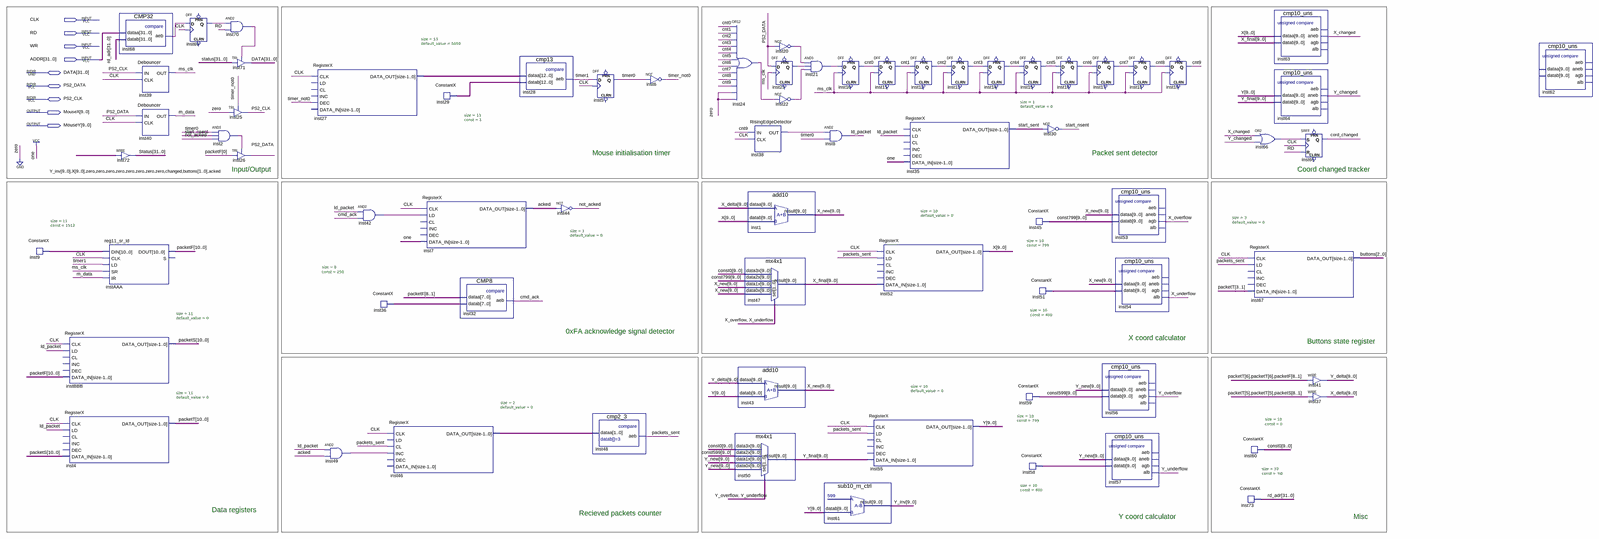
[diagram p0: schematic sheet, whole]
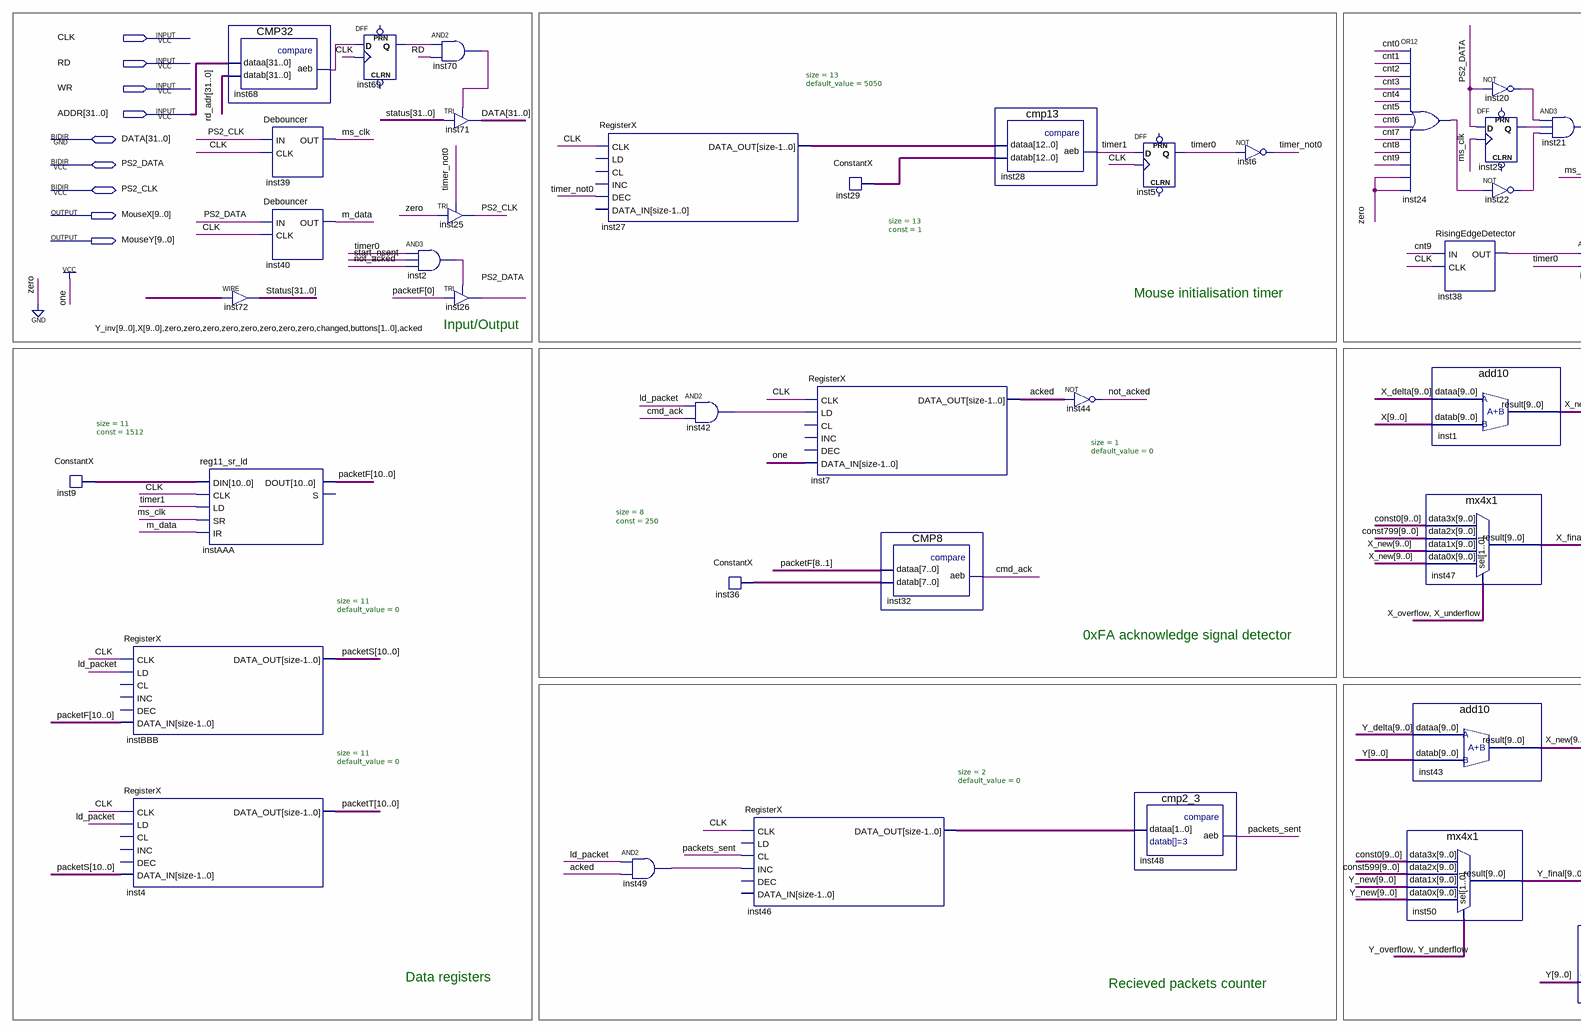
[diagram p1: schematic sheet, left part]
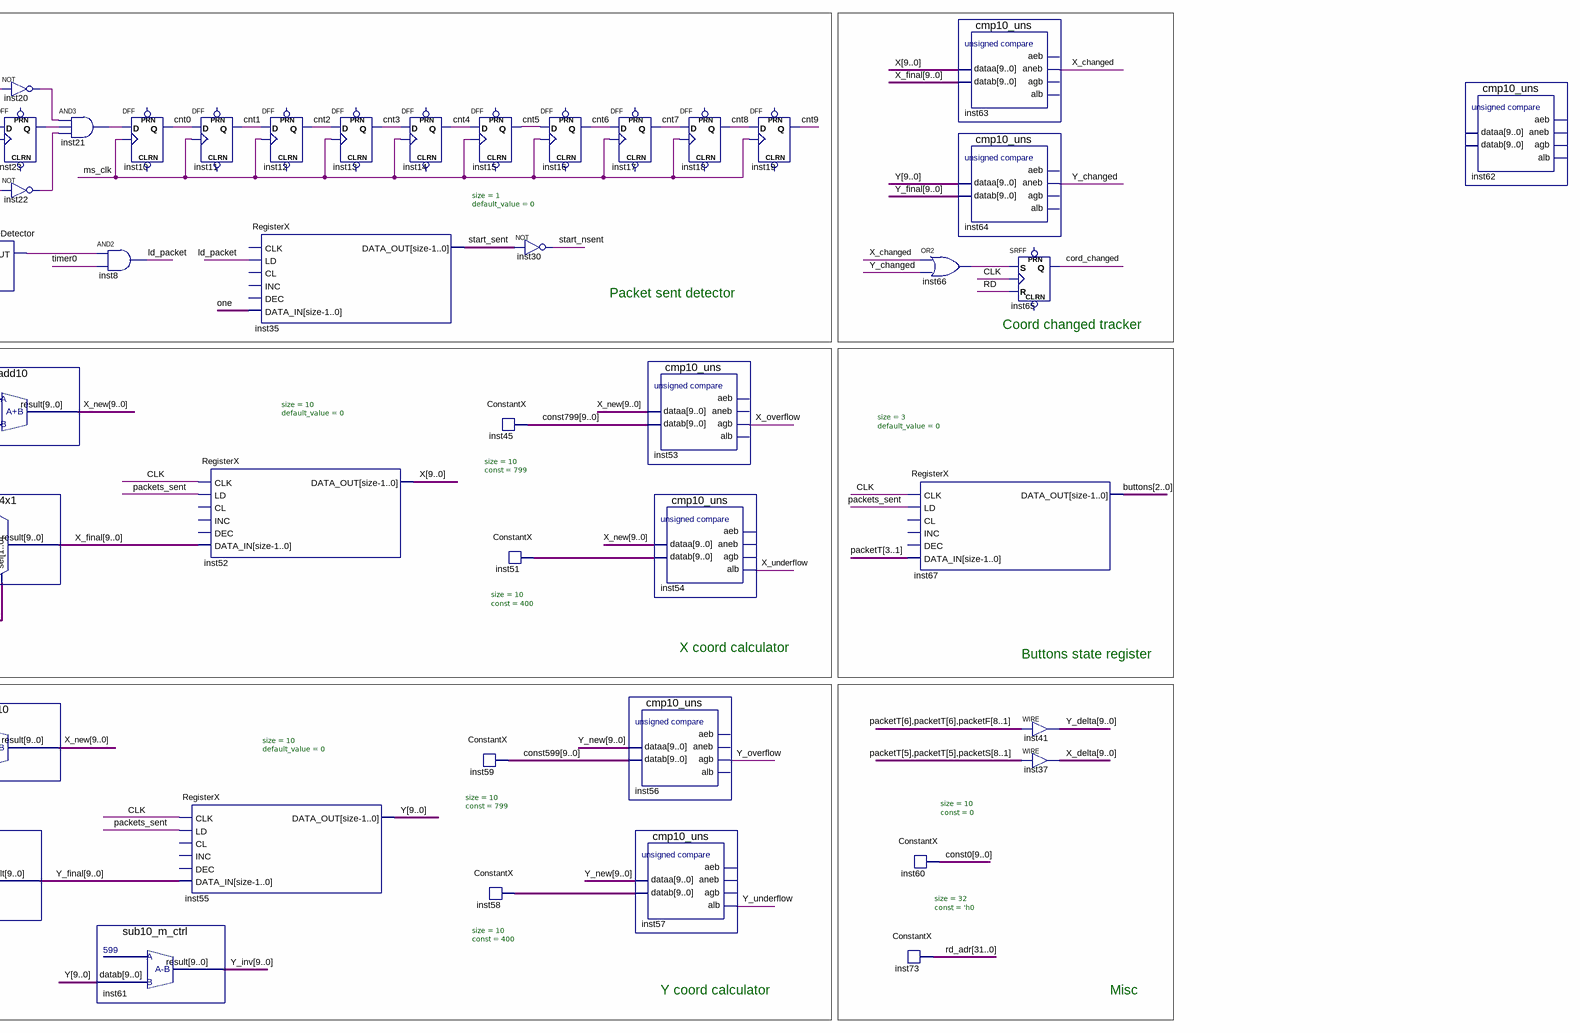
[diagram p2: schematic sheet, right part]
// Quartus schematic MouseController.bdf as structural Verilog: 71 symbols, 9 pins
module MouseController (
  input  CLK,
  input  RD,
  input  WR,
  input  [31:0] ADDR,
  inout  [31:0] DATA,
  inout  PS2_DATA,
  inout  PS2_CLK,
  output [9:0] MouseX,
  output [9:0] MouseY
);

  wire acked, changed, cmd_ack, cnt0, cnt1, cnt2, cnt3, cnt4, cnt5, cnt6, cnt7, cnt8, cnt9, cord_changed,
       inst2_out, inst20_out, inst21_out, inst22_out, inst23_q, inst24_out, inst38_out, inst42_out,
       inst49_out, inst66_out, inst68_aeb, inst69_q, inst70_out, ld_packet, m_data, ms_clk, not_acked,
       packets_sent, start_nsent, start_sent, timer0, timer1, timer_not0, X_changed, X_overflow, X_underflow,
       Y_changed, Y_overflow, Y_underflow;
  wire [1:0] inst46_data_out;
  wire [2:0] buttons;
  wire [7:0] inst36_data_out;
  wire [9:0] const0, const599, const799, inst51_data_out, inst58_data_out, X, X_delta, X_final, X_new, Y,
       Y_delta, Y_final, Y_inv, Y_new;
  wire [10:0] inst9_data_out, packetF, packetS, packetT;
  wire [12:0] inst27_data_out, inst29_data_out;
  wire [31:0] rd_adr, Status;

  ConstantX #(.size(11), .\const (1512)) inst9 (.DATA_OUT(inst9_data_out));
  RegisterX #(.size(11), .default_value(0)) instBBB (
    .CLK(CLK), .LD(ld_packet), .DATA_IN(packetF), .DATA_OUT(packetS));  // open: CL, INC, DEC
  RegisterX #(.size(11), .default_value(0)) inst4 (
    .CLK(CLK), .LD(ld_packet), .DATA_IN(packetS), .DATA_OUT(packetT));  // open: CL, INC, DEC
  reg11_sr_ld instAAA (
    .DIN(inst9_data_out), .CLK(CLK), .LD(timer1), .SR(ms_clk), .IR(m_data), .DOUT(packetF));  // open: S
  CMP32 inst68 (.dataa(ADDR), .datab(rd_adr), .aeb(inst68_aeb));
  Debouncer inst39 (.IN(PS2_CLK), .CLK(CLK), .OUT(ms_clk));
  Debouncer inst40 (.IN(PS2_DATA), .CLK(CLK), .OUT(m_data));
  assign Status = {Y_inv, X, {8{1'b0}}, changed, buttons[1:0], acked};  // WIRE inst72
  DFF inst69 (.CLK(CLK), .D(inst68_aeb), .Q(inst69_q));  // open: CLRN, PRN
  and inst2 (inst2_out, timer0, start_nsent, not_acked);
  and inst70 (inst70_out, inst69_q, RD);
  TRI inst71[31:0] (.IN(Status), .OE(inst70_out), .OUT(DATA));
  TRI inst25 (.IN(1'b0), .OE(timer_not0), .OUT(PS2_CLK));
  TRI inst26 (.IN(packetF[0]), .OE(inst2_out), .OUT(PS2_DATA));
  RegisterX #(.size(13), .default_value(5050)) inst27 (
    .CLK(CLK), .DEC(timer_not0), .DATA_OUT(inst27_data_out));  // open: LD, CL, INC, DATA_IN
  and inst49 (inst49_out, ld_packet, acked);
  and inst42 (inst42_out, ld_packet, cmd_ack);
  ConstantX #(.size(8), .\const (250)) inst36 (.DATA_OUT(inst36_data_out));
  RegisterX #(.size(2), .default_value(0)) inst46 (
    .CLK(CLK), .CL(packets_sent), .INC(inst49_out), .DATA_OUT(inst46_data_out));  // open: LD, DEC, DATA_IN
  RegisterX #(.size(1), .default_value(0)) inst7 (
    .CLK(CLK), .LD(inst42_out), .DATA_IN(1'b1), .DATA_OUT(acked));  // open: CL, INC, DEC
  ConstantX #(.size(13), .\const (1)) inst29 (.DATA_OUT(inst29_data_out));
  CMP8 inst32 (.dataa(packetF[8:1]), .datab(inst36_data_out), .aeb(cmd_ack));
  cmp13 inst28 (.dataa(inst27_data_out), .datab(inst29_data_out), .aeb(timer1));
  not inst44 (not_acked, acked);
  DFF inst5 (.CLK(CLK), .D(timer1), .Q(timer0));  // open: CLRN, PRN
  cmp2_3 inst48 (.dataa(inst46_data_out), .aeb(packets_sent));
  not inst6 (timer_not0, timer0);
  or inst24 (inst24_out, cnt0, cnt1, cnt2, cnt3, cnt4, cnt5, cnt6, cnt7, cnt8, cnt9, 1'b0, 1'b0);
  mx4x1 inst47 (
    .data3x(const0), .data2x(const799), .data1x(X_new), .data0x(X_new), .sel({X_overflow, X_underflow}),
    .result(X_final));
  add10 inst43 (.dataa(Y_delta), .datab(Y), .result(X_new));
  mx4x1 inst50 (
    .data3x(const0), .data2x(const599), .data1x(Y_new), .data0x(Y_new), .sel({Y_overflow, Y_underflow}),
    .result(Y_final));
  DFF inst23 (.CLK(ms_clk), .D(PS2_DATA), .Q(inst23_q));  // open: CLRN, PRN
  RisingEdgeDetector inst38 (.IN(cnt9), .CLK(CLK), .OUT(inst38_out));
  add10 inst1 (.dataa(X_delta), .datab(X), .result(X_new));
  not inst20 (inst20_out, PS2_DATA);
  not inst22 (inst22_out, inst24_out);
  and inst21 (inst21_out, inst20_out, inst23_q, inst22_out);
  and inst8 (ld_packet, inst38_out, timer0);
  sub10_m_ctrl inst61 (.datab(Y), .result(Y_inv));
  DFF inst10 (.CLK(ms_clk), .D(inst21_out), .Q(cnt0));  // open: CLRN, PRN
  DFF inst11 (.CLK(ms_clk), .D(cnt0), .Q(cnt1));  // open: CLRN, PRN
  RegisterX #(.size(10), .default_value(0)) inst52 (
    .CLK(CLK), .LD(packets_sent), .DATA_IN(X_final), .DATA_OUT(X));  // open: CL, INC, DEC
  RegisterX #(.size(10), .default_value(0)) inst55 (
    .CLK(CLK), .LD(packets_sent), .DATA_IN(Y_final), .DATA_OUT(Y));  // open: CL, INC, DEC
  RegisterX #(.size(1), .default_value(0)) inst35 (
    .LD(ld_packet), .DATA_IN(1'b1), .DATA_OUT(start_sent));  // open: CLK, CL, INC, DEC
  DFF inst12 (.CLK(ms_clk), .D(cnt1), .Q(cnt2));  // open: CLRN, PRN
  DFF inst13 (.CLK(ms_clk), .D(cnt2), .Q(cnt3));  // open: CLRN, PRN
  DFF inst14 (.CLK(ms_clk), .D(cnt3), .Q(cnt4));  // open: CLRN, PRN
  DFF inst15 (.CLK(ms_clk), .D(cnt4), .Q(cnt5));  // open: CLRN, PRN
  ConstantX #(.size(10), .\const (799)) inst45 (.DATA_OUT(const799));
  ConstantX #(.size(10), .\const (400)) inst51 (.DATA_OUT(inst51_data_out));
  ConstantX #(.size(10), .\const (799)) inst59 (.DATA_OUT(const599));
  ConstantX #(.size(10), .\const (400)) inst58 (.DATA_OUT(inst58_data_out));
  DFF inst16 (.CLK(ms_clk), .D(cnt5), .Q(cnt6));  // open: CLRN, PRN
  not inst30 (start_nsent, start_sent);
  DFF inst17 (.CLK(ms_clk), .D(cnt6), .Q(cnt7));  // open: CLRN, PRN
  cmp10_uns inst53 (.dataa(X_new), .datab(const799), .agb(X_overflow));  // open: aeb, aneb, alb
  cmp10_uns inst54 (.dataa(X_new), .datab(inst51_data_out), .alb(X_underflow));  // open: aeb, aneb, agb
  cmp10_uns inst56 (.dataa(Y_new), .datab(const599), .agb(Y_overflow));  // open: aeb, aneb, alb
  cmp10_uns inst57 (.dataa(Y_new), .datab(inst58_data_out), .alb(Y_underflow));  // open: aeb, aneb, agb
  DFF inst18 (.CLK(ms_clk), .D(cnt7), .Q(cnt8));  // open: CLRN, PRN
  DFF inst19 (.CLK(ms_clk), .D(cnt8), .Q(cnt9));  // open: CLRN, PRN
  RegisterX #(.size(3), .default_value(0)) inst67 (
    .CLK(CLK), .LD(packets_sent), .DATA_IN(packetT[3:1]), .DATA_OUT(buttons));  // open: CL, INC, DEC
  ConstantX #(.size(10), .\const (0)) inst60 (.DATA_OUT(const0));
  ConstantX #(.size(32), .\const ('h0)) inst73 (.DATA_OUT(rd_adr));
  cmp10_uns inst63 (.dataa(X), .datab(X_final), .aneb(X_changed));  // open: aeb, agb, alb
  cmp10_uns inst64 (.dataa(Y), .datab(Y_final), .aneb(Y_changed));  // open: aeb, agb, alb
  or inst66 (inst66_out, X_changed, Y_changed);
  SRFF inst65 (.S(inst66_out), .R(RD), .CLK(CLK), .Q(cord_changed));  // open: PRN, CLRN
  assign Y_delta = {{2{packetT[6]}}, packetF[8:1]};  // WIRE inst41
  assign X_delta = {{2{packetT[5]}}, packetS[8:1]};  // WIRE inst37
  cmp10_uns inst62 ();  // open: dataa, datab, aeb, aneb, agb, alb

  // Notes on the sheet:
  //   Mouse initialisation timer
  //   Packet sent detector
  //   Input/Output
  //   Coord changed tracker
  //   0xFA acknowledge signal detector
  //   X coord calculator
  //   Buttons state register
  //   Data registers
  //   Recieved packets counter
  //   Y coord calculator
  //   Misc
endmodule
